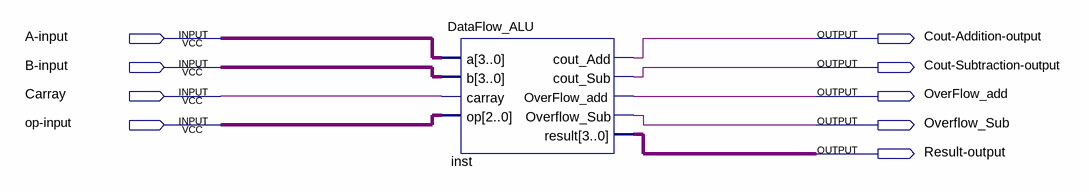
[diagram p0: schematic sheet]
// Quartus schematic DataFlow_Schematic.bdf as structural Verilog: 1 symbols, 9 pins
module DataFlow_Schematic (
  input  \A-input ,
  input  \B-input ,
  input  Carray,
  input  \op-input ,
  output \Cout-Addition-output ,
  output \Cout-Subtraction-output ,
  output OverFlow_add,
  output Overflow_Sub,
  output \Result-output 
);

  wire [2:0] undriven_3;
  wire [3:0] inst_result, undriven, undriven_2;

  DataFlow_ALU inst (
    .a(undriven), .b(undriven_2), .carray(Carray), .op(undriven_3), .cout_Add(\Cout-Addition-output ),
    .cout_Sub(\Cout-Subtraction-output ), .OverFlow_add(OverFlow_add), .Overflow_Sub(Overflow_Sub),
    .result(inst_result));
endmodule
